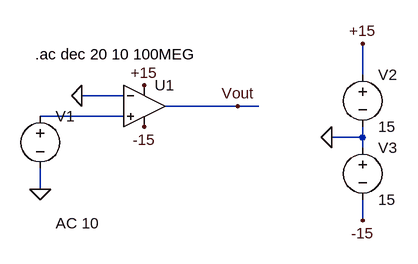
[diagram p0: schematic Comparateur-de-tension.asc]
Comparateur-de-tension.asc, the LTspice schematic file:
Version 4
SHEET 1 880 680
WIRE 528 112 528 64
WIRE 160 144 96 144
WIRE 336 160 224 160
WIRE 368 160 336 160
WIRE 160 176 32 176
WIRE 528 208 528 192
WIRE 528 208 480 208
WIRE 528 224 528 208
WIRE 32 288 32 256
WIRE 528 336 528 304
FLAG 96 144 0
FLAG 32 288 0
FLAG 336 160 Vout
FLAG 192 128 +15
FLAG 192 192 -15
FLAG 480 208 0
FLAG 528 64 +15
FLAG 528 336 -15
SYMBOL Opamps\\UniversalOpamp2 192 160 R0
SYMATTR InstName U1
SYMBOL voltage 32 160 R0
WINDOW 3 24 152 Left 2
WINDOW 123 24 180 Left 2
WINDOW 39 0 0 Left 2
SYMATTR InstName V1
SYMATTR Value ""
SYMATTR Value2 AC 10
SYMBOL voltage 528 96 R0
WINDOW 123 0 0 Left 2
WINDOW 39 0 0 Left 2
SYMATTR InstName V2
SYMATTR Value 15
SYMBOL voltage 528 208 R0
WINDOW 123 0 0 Left 2
WINDOW 39 0 0 Left 2
SYMATTR InstName V3
SYMATTR Value 15
TEXT 24 80 Left 2 !.ac dec 20 10 100MEG

The netlist it stands for:
* Comparateur-de-tension.asc
XU1 N001 0 +15 -15 Vout level.2 Avol=1Meg GBW=10Meg Slew=10Meg ilimit=25m rail=0 Vos=0 phimargin=45 en=0 enk=0 in=0 ink=0 Rin=500Meg  ; pins IN+ IN- V+ V- OUT
V1 N001 0 AC 10
V2 +15 0 15
V3 0 -15 15
.ac dec 20 10 100MEG
.lib UniversalOpamps2.sub
.backanno
.end